# EAGLE design REBEL_LED_driver (EAGLE 6.2)
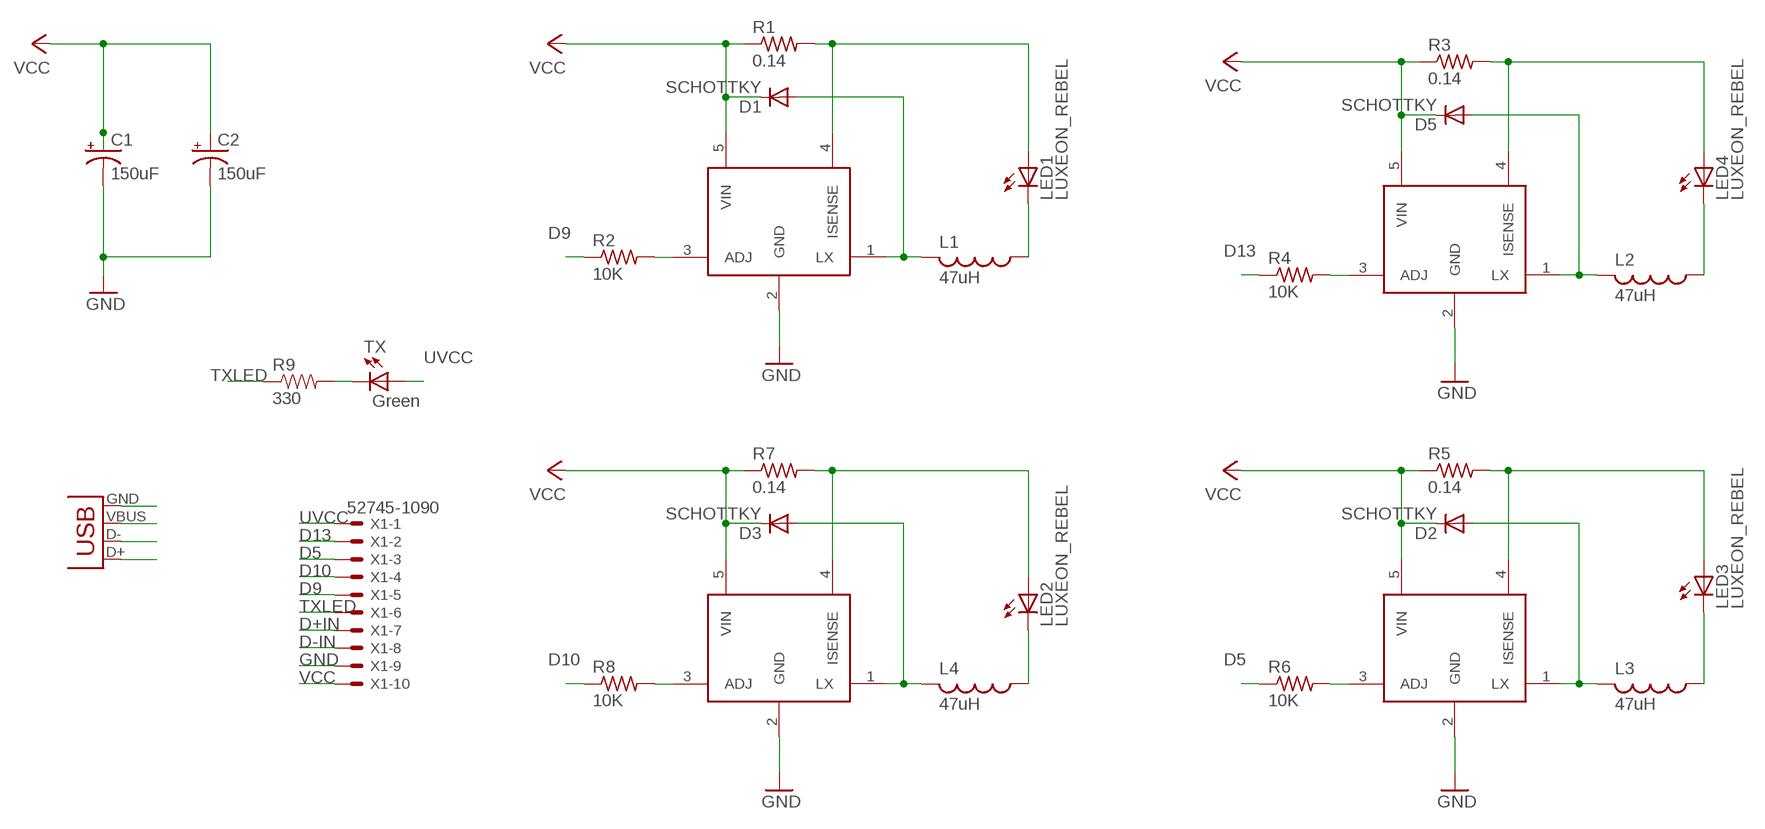
[diagram p0: schematic, sheet 1]

## Parts
C1  150uF  CPOL-US175TMP-0810  [175TMP-0810]
C2  150uF  CPOL-US175TMP-0810  [175TMP-0810]
D1  SCHOTTKY  DIODE-DO214AC  [DO214AC]
D2  SCHOTTKY  DIODE-DO214AC  [DO214AC]
D3  SCHOTTKY  DIODE-DO214AC  [DO214AC]
D5  SCHOTTKY  DIODE-DO214AC  [DO214AC]
L1  47uH  L-US  [TDK6045]
L2  47uH  L-US  [TDK6045]
L3  47uH  L-US  [TDK6045]
L4  47uH  L-US  [TDK6045]
LED1  LUXEON_REBEL  [LUXEON_REBEL]
LED2  LUXEON_REBEL  [LUXEON_REBEL]
LED3  LUXEON_REBEL  [LUXEON_REBEL]
LED4  LUXEON_REBEL  [LUXEON_REBEL]
R1  0.14  R-US_R0805  [R0805]
R2  10K  R-US_R0603  [R0603]
R3  0.14  R-US_R0805  [R0805]
R4  10K  R-US_R0603  [R0603]
R5  0.14  R-US_R0805  [R0805]
R6  10K  R-US_R0603  [R0603]
R7  0.14  R-US_R0805  [R0805]
R8  10K  R-US_R0603  [R0603]
R9  330  RESISTOR0402-RES  [0402-RES]
TX  Green  LED0603  [LED-0603]
U$2  ZLED7000-LEDDRIVER  [SOT89-5]
U$3  ZLED7000-LEDDRIVER  [SOT89-5]
U$4  ZLED7000-LEDDRIVER  [SOT89-5]
U$6  ZLED7000-LEDDRIVER  [SOT89-5]
X1  52745-1090  [52745-1090]
X2  USB-MICROB  [USB-MICROB]

## Nets
D5: R6.1 X1.3
D9: R2.1 X1.5
D10: R8.1 X1.4
D13: R4.1 X1.2
D+IN: X1.7 X2.D+
D-IN: X1.8 X2.D-
GND: C1.- C2.- U$2.2(GND) U$3.2(GND) U$4.2(GND) U$6.2(GND) X1.9 X2.GND
N$1: R2.2 U$2.3(ADJ)
N$2: R9.2 TX.C
N$3: LED1.A LED1.A@1(A) R1.2 U$2.4(ISENSE)
N$4: L1.1 LED1.C LED1.C@1(C)
N$5: D1.A L1.2 U$2.1(LX)
N$6: LED4.A LED4.A@1(A) R3.2 U$6.4(ISENSE)
N$7: D5.A L2.2 U$6.1(LX)
N$8: R4.2 U$6.3(ADJ)
N$10: LED3.A LED3.A@1(A) R5.2 U$3.4(ISENSE)
N$11: D2.A L3.2 U$3.1(LX)
N$12: R6.2 U$3.3(ADJ)
N$14: LED2.A LED2.A@1(A) R7.2 U$4.4(ISENSE)
N$15: D3.A L4.2 U$4.1(LX)
N$16: R8.2 U$4.3(ADJ)
N$18: L4.1 LED2.C LED2.C@1(C)
N$19: L2.1 LED4.C LED4.C@1(C)
N$20: L3.1 LED3.C LED3.C@1(C)
TXLED: R9.1 X1.6
UVCC: TX.A X1.1 X2.VBUS
VCC: C1.+ C2.+ D1.C D2.C D3.C D5.C R1.1 R3.1 R5.1 R7.1 U$2.5(VIN) U$3.5(VIN) U$4.5(VIN) U$6.5(VIN) X1.10

## Power pins joined to a net without a drawn wire
TH: LED1.TH LED1.TH@1(TH) LED1.TH@2(TH) LED1.TH@3(TH) LED1.TH@4(TH) LED2.TH LED2.TH@1(TH) LED2.TH@2(TH) LED2.TH@3(TH) LED2.TH@4(TH) LED3.TH LED3.TH@1(TH) LED3.TH@2(TH) LED3.TH@3(TH) LED3.TH@4(TH) LED4.TH LED4.TH@1(TH) LED4.TH@2(TH) LED4.TH@3(TH) LED4.TH@4(TH)

## Library data of the parts
C1 C2 = adafruit:CPOL-US: POLARIZED CAPACITOR, American symbol
D1-D3 D5 = diode:DIODE-: DIODE
L1-L4 = rcl:L-US: INDUCTOR, American symbol
LED1-LED4 = led-lumiled:LUXEON_REBEL: LUXEON Rebel Display layer 93, Pins, and connect all contact points with a net. The thermal pads are defined in a separate gate with addlevel REQUEST. Draw a net named 'TH' and connect all thermal pads with it. Please read the Package's Description about DRC settings. Source: http://www.lumileds.com/pdfs/AB32.pdf; OC_FARNELL: unknown; OC_NEWARK: unknown
R1-R8 = adafruit:R-US_: RESISTOR, American symbol
R9 = SparkFun:RESISTOR: Resistor Basic schematic elements and footprints for 0603, 1206, and PTH resistors.
TX = SparkFun:LED: LEDs Standard schematic elements and footprints for 5mm, 3mm, 1206, and 0603 sized LEDs. 5mm - Spark Fun Electronics SKU : COM-00529 (and others)
U$2-U$4 U$6 = adafruit:ZLED7000-LEDDRIVER
X1 = con-molex:52745-1090: FFC/FPC-to-Board 0.50mm (.020") SMT Top Contact Right Angle, ZIF, Style Receptacle 52745 / 52435 Source: http://www.molex.com/product/ffc/52745.html; MPN: 52745-1090; OC_FARNELL: unknown; OC_NEWARK: 92M6380
X2 = SparkFun-Connectors:USB: USB Connectors USB-B-PTH is fully proven SKU : PRT-00139 USB-miniB is fully proven SKU : PRT-00587 USB-A-PCB is untested. USB-A-H is throughly reviewed, but untested. Spark Fun Electronics SKU : PRT-00437 USB-B-SMT is throughly reviewed, but untested. Needs silkscreen touching up. USB-A-S has not been used/tested USB-MB-H has not been used/tested

## Net classes
0 default: width 0.003 mm, drill 0.254 mm, clearance 0.152 mm

## Board
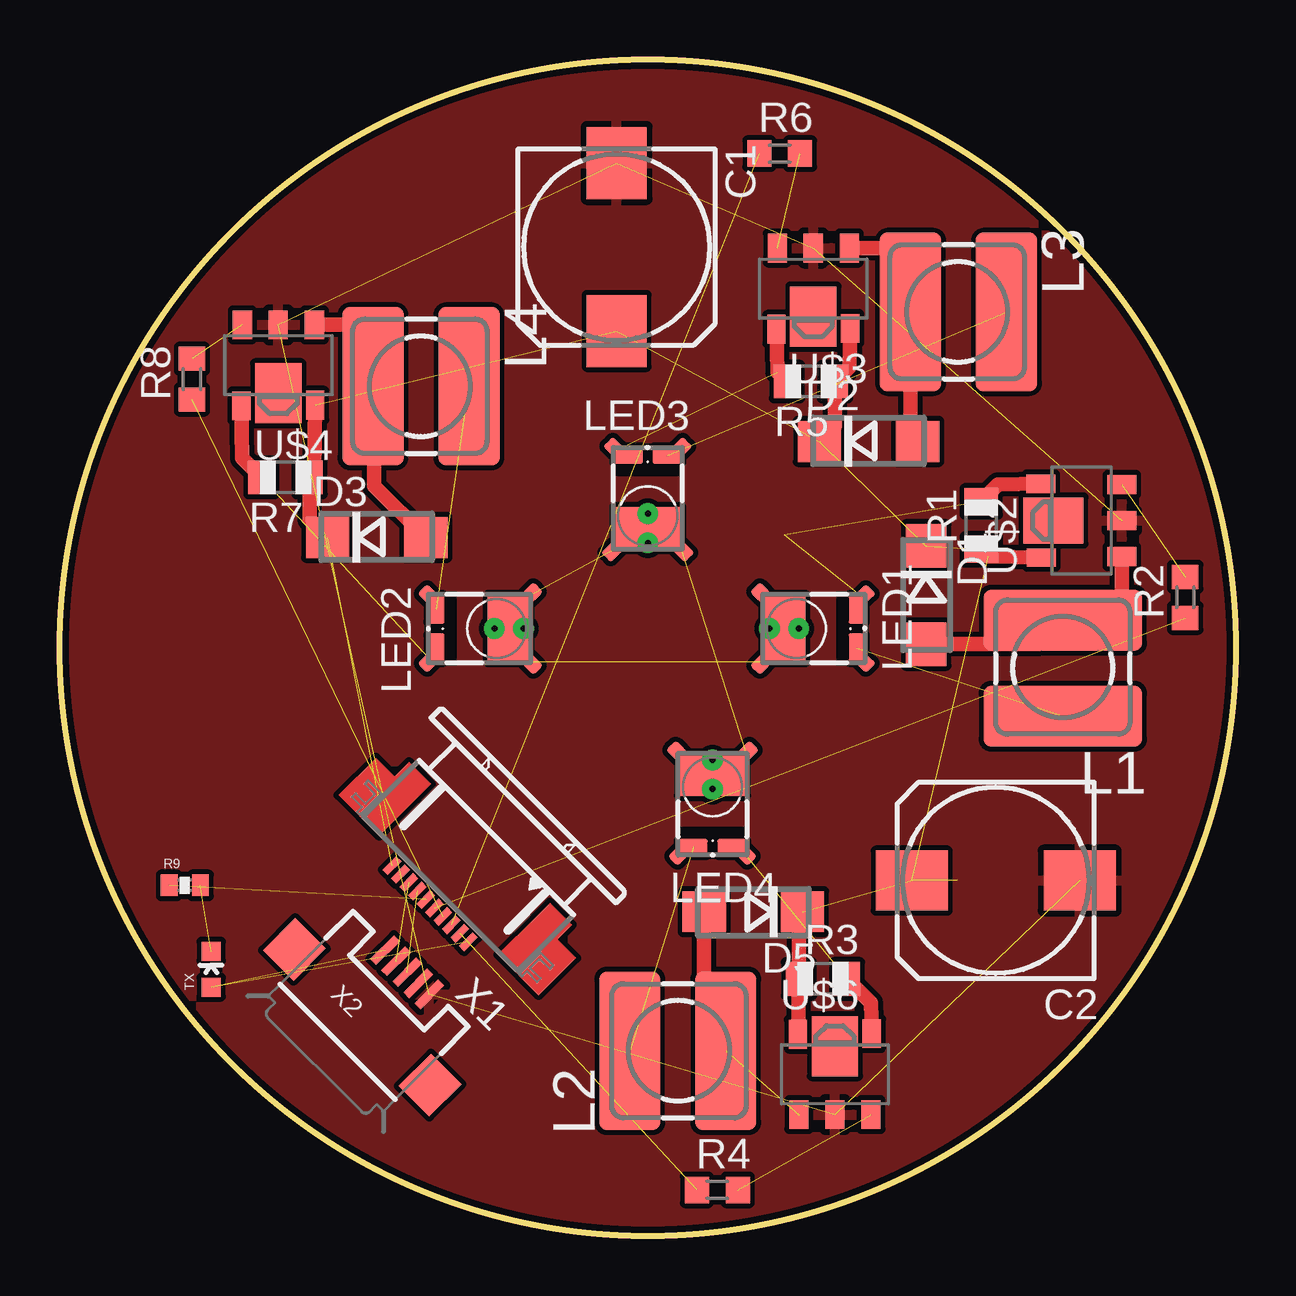
[diagram p1: board, top side]

Size 49 x 49 mm. Coordinates in mm from the lower left corner, seen from the top.
Outline: circle at 24.5,24.5 radius 24.5
Copper layers (1*16): Top 0.035mm / dielectric 1.5mm / Bottom 0.035mm
Design rules: minimum track width 8mil, minimum drill 20mil, track to track 8mil, track to pad 8mil, pad to pad 8mil, via to via 8mil, smd to smd 8mil, copper to edge 10mil, drill to drill 8mil, minimum pad ring 12mil, minimum via ring 10mil, stop-mask expansion 4mil, vias tented up to drill 25mil, thermal gap 10mil

### Footprints (pad centres in the part's own frame; a part is rotated, then mirrored left to right if it is on the bottom)
175TMP-0810 = smd 3 x 2.5: + 3.5,0; - -3.5,0
DO214AC = smd 1.8 x 1.7: A 2.05,0; C -2.05,0
TDK6045 = smd 6.6 x 2.55: 1 0,2.05; 2 0,-1.95
LUXEON_REBEL = smd 1.2 x 0.67: A 0.8,-2.51; C -0.8,-2.51 | smd 1 x 0.6 rotated 315: A@1 1.31,-2.75 | smd 1 x 0.6 rotated 225: C@1 -1.31,-2.75 | smd 2.8 x 1.77: TH 0,0.51 | smd 1 x 0.6 rotated 135: TH@1 -1.39,1.39 | smd 1 x 0.6 rotated 45: TH@2 1.39,1.39 | drill 0.25 pad 0.4: TH@3 0,-0.095; TH@4 0,1.125
R0805 = smd 1.1 x 1.4: 1 -1,0; 2 1,0
R0603 = smd 1 x 1.1: 1 -0.85,0; 2 0.85,0
0402-RES = smd 0.7 x 0.9: 1 -0.65,0; 2 0.65,0
LED-0603 = smd 0.8 x 0.8: A 0,-0.75; C 0,0.75
SOT89-5 = smd 0.8 x 1.2: 1 -1.5,-2.362; 2 0.001,-2.362; 3 1.5,-2.362 | smd 0.762 x 1.2: 4 1.538,1.016; 5 -1.538,0.991 | smd 1.93 x 2.5: THEM 0,0.488
52745-1090 = smd 0.3 x 0.8: 1 -2.25,2.5; 2 -1.75,2.5; 3 -1.25,2.5; 4 -0.75,2.5; 5 -0.25,2.5; 6 0.25,2.5; 7 0.75,2.5; 8 1.25,2.5; 9 1.75,2.5; 10 2.25,2.5
USB-MICROB = smd 0.35 x 1.4: D+ 0,2.65; D- -0.65,2.65; GND 1.3,2.65; ID 0.65,2.65; VBUS -1.3,2.65 | smd 1.8 x 1.9: MT1 -4,0; MT2 4,0

### Placement (x,y rotation side)
C1  23.2,41.2 270 top
C2  39,14.8 180 top
D1  36.1,26.7 270 top
D2  33.7,33.1 0 top
D3  13.2,29.1 0 top
D5  28.9,13.5 180 top
L1  41.8,23.7 180 top
L2  25.8,7.7 90 top
L3  37.4,38.5 270 top
L4  15,35.4 270 top
LED1  30.7,25.3 90 top
LED2  18.2,25.3 270 top
LED3  24.5,30 180 top
LED4  27.2,18.7 0 top
R1  38.4,29.6 90 top
R2  46.9,26.6 90 top
R3  31.8,10.7 0 top
R4  27.4,1.9 0 top
R5  31.3,35.6 180 top
R6  30,45.1 0 top
R7  9.4,31.6 180 top
R8  5.5,35.7 90 top
R9  5.2,14.6 0 top
TX  6.3,11.1 0 top
U$2  41.9,29.8 90 top
U$3  31.4,38.8 180 top
U$4  9.1,35.6 180 top
U$6  32.3,7.4 0 top
X1  17.2,15.6 135 top
X2  12.6,9.1 315 top

### Tracks (layer width: path | path; a pad name or v marks a point on that pad's centre or on a via)
D5  (1 unrouted)
D9  (1 unrouted)
D10  (1 unrouted)
D13  (1 unrouted)
D+IN  (1 unrouted)
D-IN  (1 unrouted)
GND  (7 unrouted)
  pour Top: 7,41.8 arc-90 41.8,41.8 41.8,41.7 41.9,41.7 arc-90 41.9,7.3 arc-90 6.9,7.3 arc-90 6.9,41.8
N$1  (1 unrouted)
N$2  (1 unrouted)
N$3  (2 unrouted)
  Top 0.61: U$2.4 39.1,31.3 R1.2
N$4  (1 unrouted)
N$5
  Top 0.61: U$2.1 44.26,26.06 44,25.8 41.95,25.8 L1.2 40.8,24.65 D1.A
N$6  (1 unrouted)
  Top 0.61: U$6.4 33.8,9.7 R3.2
N$7  (1 unrouted)
  Top 0.61: D5.A 26.85,8.6 L2.2
N$8  (1 unrouted)
N$10  (1 unrouted)
  Top 0.61: U$3.4 29.9,36 R5.2
N$11
  Top 0.61: U$3.1 34.54,41.16 35.2,40.5 35.2,38.75 L3.2 35.45,33.4 D2.A
N$12  (1 unrouted)
N$14  (1 unrouted)
  Top 0.61: U$4.4 7.6,32.4 R7.2
N$15
  Top 0.61: U$4.1 12.64,37.96 12.8,37.8 12.8,35.65 L4.2 13.05,34.75 13.1,34.7 13.1,31.25 D3.A
N$16  (1 unrouted)
N$18  (1 unrouted)
N$19  (1 unrouted)
N$20  (1 unrouted)
TH  (3 unrouted)
TXLED  (1 unrouted)
UVCC  (2 unrouted)
VCC  (8 unrouted)
  Top 0.61: U$4.5 10.6,31.8 R7.1 10.4,29.85 D3.C | U$6.5 R3.1 30.8,13.35 D5.C | U$2.5 38.7,28.3 R1.1 | U$3.5 32.9,36.2 R5.1 32.3,33.75 D2.C